# Altium schematic sheet 6_Rectifier.SCHDOC
size 297 x 209 mm; SheetNumber: 18; SheetTotal: 18; DocumentName: 6_Rectifier.SCHDOC
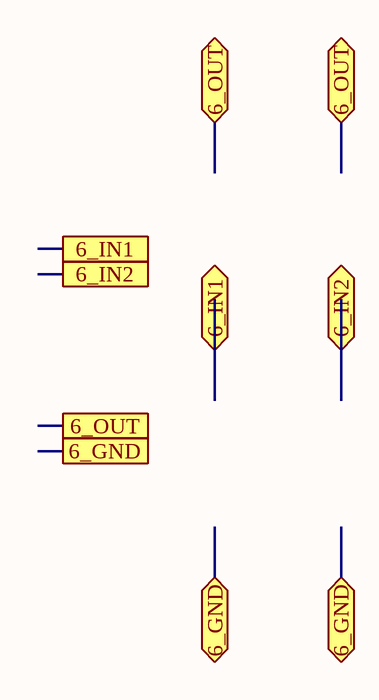
[diagram p0: 6_Rectifier.SCHDOC]

## Ports
6_GND, 6_IN1, 6_IN2, 6_OUT

## Notes on the sheet
- A
- B
- C
- D
- 1
- 2
- 3
- Title
- 4
- Size
- A4
- Number
- Rev
- Date
- Filename
- Drawn by
- Sheet
- of